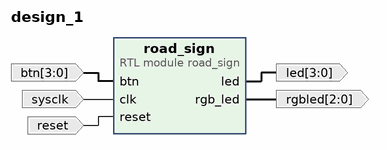
[diagram p0: block diagram of the top level]
# Vivado block design design_1, xc7z020clg400-1, Vivado 2023.2
create_bd_design design_1

create_bd_port -dir I -type clk sysclk
create_bd_port -dir I -type rst reset
create_bd_port -dir O -from 3 -to 0 led
create_bd_port -dir I -from 3 -to 0 btn
create_bd_port -dir O -from 2 -to 0 rgbled

create_bd_cell -type module -reference road_sign road_sign

# ---- connections ----

connect_bd_net -net btn_0_1 [get_bd_ports btn] [get_bd_pins road_sign/btn]
connect_bd_net -net clk_0_1 [get_bd_ports sysclk] [get_bd_pins road_sign/clk]
connect_bd_net -net reset_0_1 [get_bd_ports reset] [get_bd_pins road_sign/reset]
connect_bd_net -net road_sign_0_out [get_bd_pins road_sign/led] [get_bd_ports led]
connect_bd_net [get_bd_pins road_sign/rgb_led] [get_bd_ports rgbled]

validate_bd_design
save_bd_design
